# Altium schematic sheet PHY-AUDIO-HDMI-TVout.SchDoc
size A4; SheetNumber: 5; SheetTotal: 8
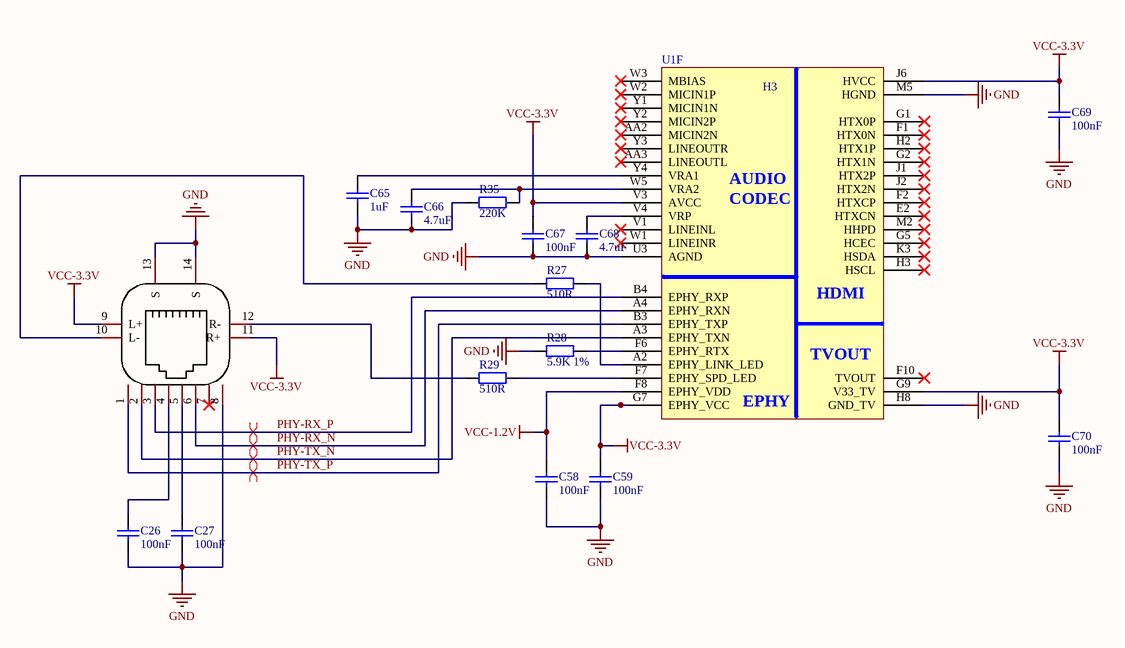
[diagram p0: PHY-AUDIO-HDMI-TVout.SchDoc]

## Parts
C26  100nF  [0402_C]
C27  100nF  [0402_C]
C58  100nF  [0402_C]
C59  100nF  [0402_C]
C65  1uF  [0402_C]
C66  4.7uF  [0402_C]
C67  100nF  [0402_C]
C68  4.7uF  [0402_C]
C69  100nF  [0402_C]
C70  100nF  [0402_C]
R27  510R  [0402_R]
R28  5.9K 1%  [0402_R]
R29  510R  [0402_R]
R35  220K  [0402_R]
RJ1  R-RJ45R08P-C000  [R-RJ45R08P-C000]  (value not drawn)
U1  H3  [allwinner-h3]  (part F of 9)

## Nets
GND: C26.2 C27.2 C58.2 C59.2 C65.2 C66.2 C67.2 C68.2 C69.2 C70.2 R28.1 R35.1 RJ1.8 RJ1.13(S) RJ1.14(S) U1.H8(GND_TV) U1.M5(HGND) U1.U3(AGND)
VCC-1.2V: C58.1 U1.F8(EPHY_VDD)
VCC-3.3V: C59.1 C67.1 C69.1 C70.1 RJ1.9(L+) RJ1.11(R+) U1.G7(EPHY_VCC) U1.G9(V33_TV) U1.J6(HVCC) U1.V3(AVCC)
PHY-RX_N: RJ1.6 U1.A4(EPHY_RXN)
PHY-RX_P: RJ1.3 U1.B4(EPHY_RXP)
PHY-TX_N: RJ1.2 U1.A3(EPHY_TXN)
PHY-TX_P: RJ1.1 U1.B3(EPHY_TXP)
NetC26_1: C26.1 RJ1.4
NetC27_1: C27.1 RJ1.5
NetC65_1: C65.1 U1.Y4(VRA1)
NetC66_1: C66.1 R35.2 U1.W5(VRA2)
NetC68_1: C68.1 U1.V4(VRP)
NetR27_1: R27.1 RJ1.10(L-)
NetR27_2: R27.2 U1.A2(EPHY_LINK_LED)
NetR28_2: R28.2 U1.F6(EPHY_RTX)
NetR29_1: R29.1 RJ1.12(R-)
NetR29_2: R29.2 U1.F7(EPHY_SPD_LED)

Not connected (* = marked no-connect by the designer): RJ1 7*; U1 AA2(MICIN2N)* AA3(LINEOUTL)* E2(HTXCN)* F1(HTX0N)* F2(HTXCP)* F10(TVOUT)* G1(HTX0P)* G2(HTX1N)* G5(HCEC)* H2(HTX1P)* H3(HSCL)* J1(HTX2P)* J2(HTX2N)* K3(HSDA)* M2(HHPD)* V1(LINEINL)* W1(LINEINR)* W2(MICIN1P)* W3(MBIAS)* Y1(MICIN1N)* Y2(MICIN2P)* Y3(LINEOUTR)*

## Layout directives
differential pair: PHY-RX_N, PHY-RX_P, PHY-TX_N, PHY-TX_P

## Notes on the sheet
- (in symbol H3_CPU, part F) AUDIO; CODEC; HDMI; EPHY

## Library data of the parts
C26 C27 C58 C59 C65-C70 = CAP-SMD: smd capacitor
R27-R29 R35 = RES-SMD: smd resistor
RJ1 = R-RJ45R08P-C000: RJ45
U1 = H3_CPU: CPU